# Altium schematic sheet TFCard_SMD(SHOUHAN).schdoc
size 124 x 99 mm
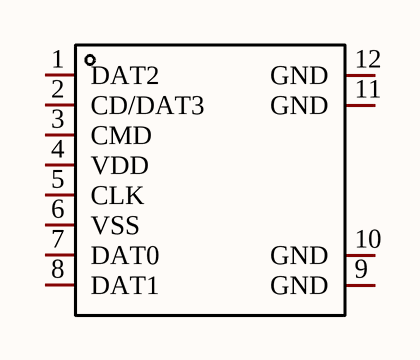
[diagram p0: TFCard_SMD(SHOUHAN).schdoc]

## Parts
TF?  TF-CARD XG8P H1.5  [TF-SMD_TF-CARD-XG8P-H1.5]  (value not drawn)

## Nets

Not connected (* = marked no-connect by the designer): TF? 1(DAT2) 2(CD/DAT3) 3(CMD) 4(VDD) 5(CLK) 6(VSS) 7(DAT0) 8(DAT1) 9(GND) 10(GND) 11(GND) 12(GND)

## Library data of the parts
TF? = TF-CARD XG8P H1.5: Manufacturer: SHOU HAN(首韩); Add into BOM: yes; Card Connection Mode: 翻盖式; Card Type: MicroSD卡(TF卡); Connector Type: 卡座; Maximum Body Height: 1.5mm; Symbol: TF-CARD XG8P H1.5; Device: TF-CARD XG8P H1.5; Supplier: LCSC; Supplier Part: C7529392; Manufacturer Part: TF-CARD XG8P H1.5; LCSC Part Name: 翻盖式 MicroSD卡(TF卡) 卡座; Supplier Footprint: SMD; Datasheet: https://atta.szlcsc.com/upload/public/pdf/source/20230818/43241E7A29C04DDA786CC83B7C2D0D9E.pdf; Convert to PCB: yes; Contact Material: 铜合金; Contact Plating: 金; Operating Temperature Range: -40℃~+70℃